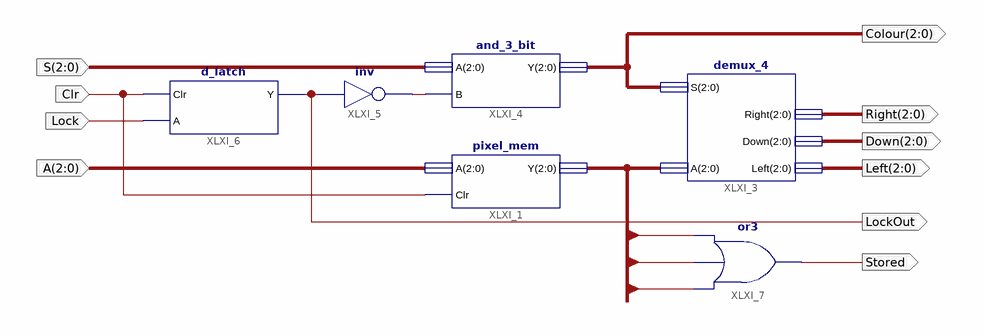
[diagram p0: schematic sheet 1]
// Xilinx ISE schematic pixel_store.sch (artix7) as structural Verilog: 6 symbols, 10 ports
module pixel_store (
  input  [2:0] S,
  input  Lock,
  input  Clr,
  input  [2:0] A,
  output [2:0] Colour,
  output LockOut,
  output Stored,
  output [2:0] Right,
  output [2:0] Down,
  output [2:0] Left
);

  wire XLXN_4;
  wire [2:0] Y;

  pixel_mem XLXI_1 (.A(A), .Clr(Clr), .Y(Y));
  demux_4 XLXI_3 (.S(Colour), .A(Y), .Right(Right), .Down(Down), .Left(Left));
  and_3_bit XLXI_4 (.A(S), .B(XLXN_4), .Y(Colour));
  not XLXI_5 (XLXN_4, LockOut);
  d_latch XLXI_6 (.Clr(Clr), .A(Lock), .Y(LockOut));
  or XLXI_7 (Stored, Y[2], Y[1], Y[0]);
endmodule
